# Altium schematic sheet Sheet1.SchDoc
size A3
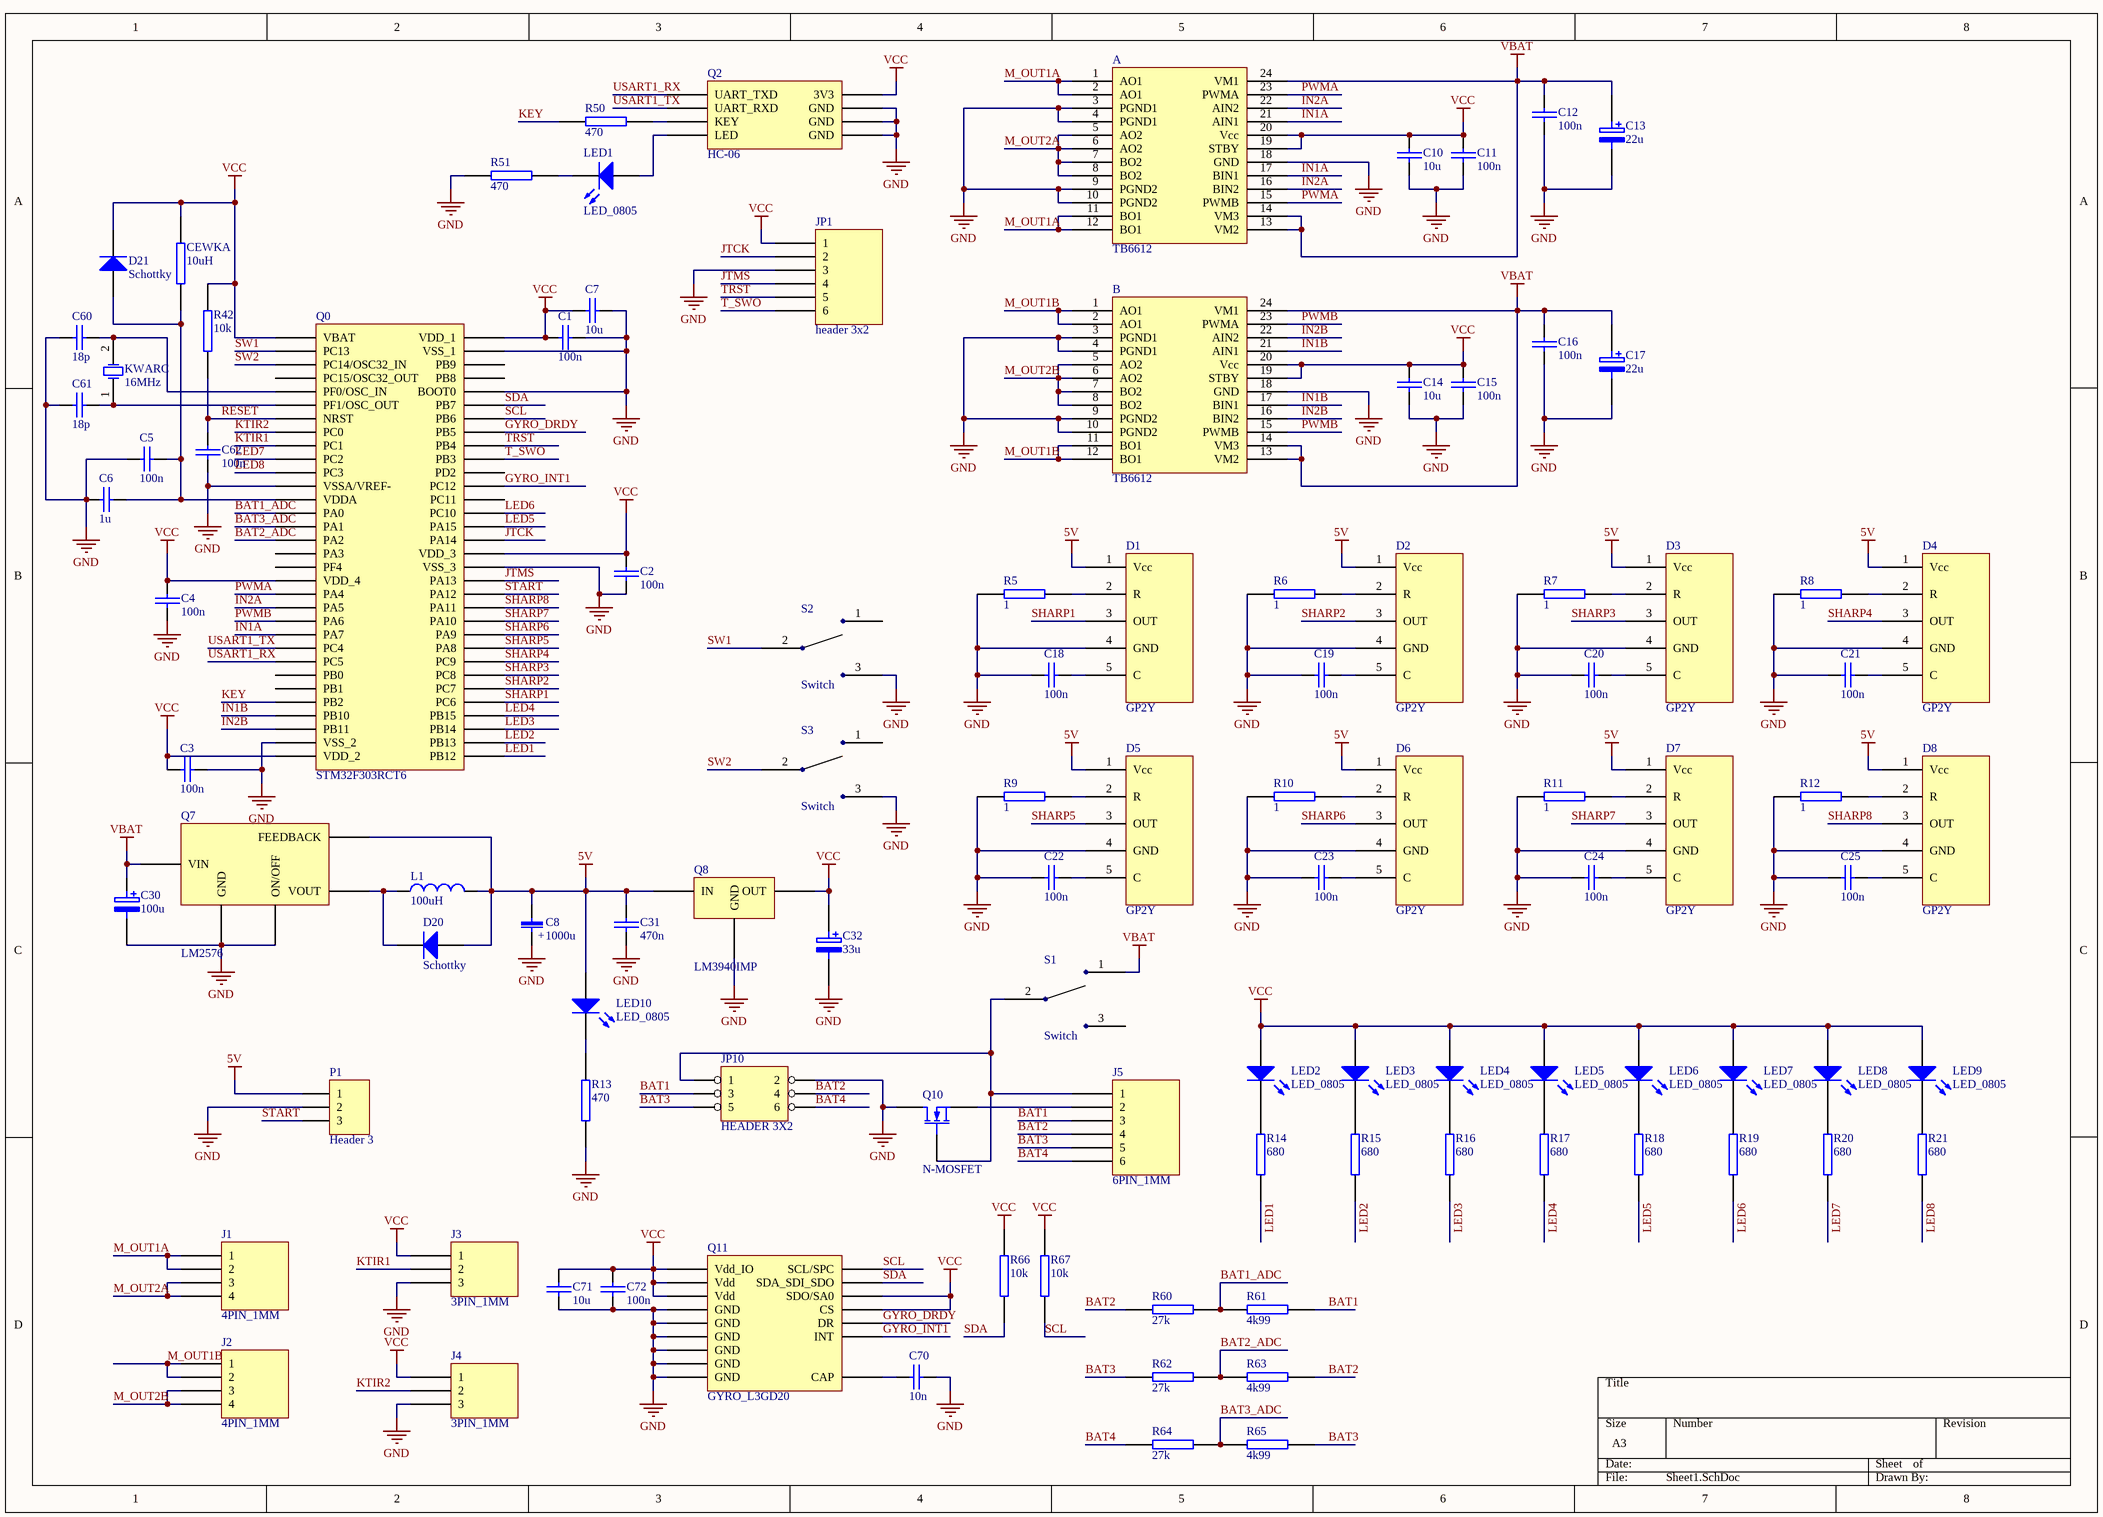
[diagram p0: Sheet1.SchDoc]

## Parts
A  TB6612  [SSOP24]
B  TB6612  [SSOP24]
C1  100n  [0805 CAP]
C2  100n  [0805 CAP]
C3  100n  [0805 CAP]
C4  100n  [0805 CAP]
C5  100n  [0805 CAP]
C6  1u  [0805 CAP]
C7  10u  [0805 CAP]
C8  1000u  [F720J108MMC]
C10  10u  [0805 CAP]
C11  100n  [0805 CAP]
C12  100n  [0805 CAP]
C13  22u  [TANTAL_A]
C14  10u  [0805 CAP]
C15  100n  [0805 CAP]
C16  100n  [0805 CAP]
C17  22u  [TANTAL_A]
C18  100n  [0805 CAP]
C19  100n  [0805 CAP]
C20  100n  [0805 CAP]
C21  100n  [0805 CAP]
C22  100n  [0805 CAP]
C23  100n  [0805 CAP]
C24  100n  [0805 CAP]
C25  100n  [0805 CAP]
C30  100u  [TANTAL_C]
C31  470n  [0805 CAP]
C32  33u  [TANTAL_C]
C60  18p  [0805 CAP]
C61  18p  [0805 CAP]
C62  100n  [0805 CAP]
C70  10n  [0805]
C71  10u  [0805]
C72  100n  [0805]
CEWKA  10uH  [0805]
D1  GP2Y  [gp2y smd]
D2  GP2Y  [gp2y smd]
D3  GP2Y  [gp2y smd]
D4  GP2Y  [gp2y smd]
D5  GP2Y  [gp2y smd]
D6  GP2Y  [gp2y smd]
D7  GP2Y  [gp2y smd]
D8  GP2Y  [gp2y smd]
D20  Schottky  [SMB]
D21  Schottky  [SMB]
J1  4PIN_1MM  [CON_1mm_4pin]
J2  4PIN_1MM  [CON_1mm_4pin]
J3  3PIN_1MM  [CON_1MM_3PIN]
J4  3PIN_1MM  [CON_1MM_3PIN]
J5  6PIN_1MM  [6pin]
JP1  header 3x2  [MM3X2 SMD]
JP10  HEADER 3X2  [MM3X2 SMD]
KWARC  16MHz  [KWARC_16M]
L1  100uH  [CEWKA]
LED1  LED_0805  [0805]
LED2  LED_0805  [0805]
LED3  LED_0805  [0805]
LED4  LED_0805  [0805]
LED5  LED_0805  [0805]
LED6  LED_0805  [0805]
LED7  LED_0805  [0805]
LED8  LED_0805  [0805]
LED9  LED_0805  [0805]
LED10  LED_0805  [0805]
P1  Header 3  [HDR1X3]
Q0  STM32F303RCT6  [STM32F303RCT6]
Q2  HC-06  [PCBComponent_1]
Q7  LM2576  [LM2576]
Q8  LM3940IMP  [LM3940IMP]
Q10  N-MOSFET  [DPAK]
Q11  GYRO_L3GD20  [GYRO_L3GD20]
R5  1  [0805 RES]
R6  1  [0805 RES]
R7  1  [0805 RES]
R8  1  [0805 RES]
R9  1  [0805 RES]
R10  1  [0805 RES]
R11  1  [0805 RES]
R12  1  [0805 RES]
R13  470  [0805 RES]
R14  680  [0805 RES]
R15  680  [0805 RES]
R16  680  [0805 RES]
R17  680  [0805 RES]
R18  680  [0805 RES]
R19  680  [0805 RES]
R20  680  [0805 RES]
R21  680  [0805 RES]
R42  10k  [0805]
R50  470  [0805 RES]
R51  470  [0805 RES]
R60  27k  [0805]
R61  4k99  [0805]
R62  27k  [0805]
R63  4k99  [0805]
R64  27k  [0805]
R65  4k99  [0805]
R66  10k  [0805]
R67  10k  [0805]
S1  Switch  [Switch]
S2  Switch  [Switch]
S3  Switch  [Switch]

## Nets
5V: C8.1 C31.2 D1.1(Vcc) D2.1(Vcc) D3.1(Vcc) D4.1(Vcc) D5.1(Vcc) D6.1(Vcc) D7.1(Vcc) D8.1(Vcc) D20.1(A) L1.2 LED10.2(A) P1.1 Q7.4(FEEDBACK) Q8.IN
GND: A.3(PGND1) A.4(PGND1) A.9(PGND2) A.10(PGND2) A.18(GND) B.3(PGND1) B.4(PGND1) B.9(PGND2) B.10(PGND2) B.18(GND) C1.2 C2.2 C3.2 C4.2 C5.2 C6.1 C7.2 C8.2 C10.2 C11.2 C12.2 C13.2 C14.2 C15.2 C16.2 C17.2 C18.1 C19.1 C20.1 C21.1 C22.1 C23.1 C24.1 C25.1 C30.2 C31.1 C32.2 C60.1 C61.2 C62.2 C70.1 C71.2 C72.2 D1.4(GND) D2.4(GND) D3.4(GND) D4.4(GND) D5.4(GND) D6.4(GND) D7.4(GND) D8.4(GND) J3.3 J4.3 JP1.3 JP10.2 P1.2 Q0.12(VSSA/VREF-) Q0.31(VSS_2) Q0.47(VSS_3) Q0.60(BOOT0) Q0.63(VSS_1) Q2.4(GND) Q2.5(GND) Q2.6(GND) Q7.3(GND) Q7.5(ON/OFF) Q8.GND Q10.2(D) Q11.8(GND) Q11.9(GND) Q11.10(GND) Q11.11(GND) Q11.12(GND) Q11.13(GND) R5.1 R6.1 R7.1 R8.1 R9.1 R10.1 R11.1 R12.1 R13.1 R51.1 S2.3 S3.3
VBAT: A.13(VM2) A.14(VM3) A.24(VM1) B.13(VM2) B.14(VM3) B.24(VM1) C12.1 C13.1 C16.1 C17.1 C30.1 Q7.1(VIN) S1.1
VCC: A.19(STBY) A.20(Vcc) B.19(STBY) B.20(Vcc) C1.1 C2.1 C3.1 C4.1 C7.1 C10.1 C11.1 C14.1 C15.1 C32.1 C71.1 C72.1 CEWKA.2 D21.2(K) J3.1 J4.1 JP1.1 LED2.2(A) LED3.2(A) LED4.2(A) LED5.2(A) LED6.2(A) LED7.2(A) LED8.2(A) LED9.2(A) Q0.1(VBAT) Q0.19(VDD_4) Q0.32(VDD_2) Q0.48(VDD_3) Q0.64(VDD_1) Q2.3(3V3) Q8.OUT Q11.1(Vdd_IO) Q11.4(SDO/SA0) Q11.5(CS) Q11.15(Vdd) Q11.16(Vdd) R42.2 R66.1 R67.1
BAT1: J5.3 JP10.3 R61.1
BAT1_ADC: Q0.14(PA0) R60.1 R61.2
BAT2: J5.4 JP10.4 R60.2 R63.1
BAT2_ADC: Q0.16(PA2) R62.1 R63.2
BAT3: J5.5 JP10.5 R62.2 R65.1
BAT3_ADC: Q0.15(PA1) R64.1 R65.2
BAT4: J5.6 JP10.6 R64.2
GYRO_DRDY: Q0.57(PB5) Q11.6(DR)
GYRO_INT1: Q0.53(PC12) Q11.7(INT)
IN1A: A.17(BIN1) A.21(AIN1) Q0.23(PA7)
IN1B: B.17(BIN1) B.21(AIN1) Q0.29(PB10)
IN2A: A.16(BIN2) A.22(AIN2) Q0.21(PA5)
IN2B: B.16(BIN2) B.22(AIN2) Q0.30(PB11)
JTCK: JP1.2 Q0.49(PA14)
JTMS: JP1.4 Q0.46(PA13)
KEY: Q0.28(PB2) R50.1
KTIR1: J3.2 Q0.9(PC1)
KTIR2: J4.2 Q0.8(PC0)
LED1: Q0.33(PB12) R14.1
LED2: Q0.34(PB13) R15.1
LED3: Q0.35(PB14) R16.1
LED4: Q0.36(PB15) R17.1
LED5: Q0.50(PA15) R18.1
LED6: Q0.51(PC10) R19.1
LED7: Q0.10(PC2) R20.1
LED8: Q0.11(PC3) R21.1
M_OUT1A: A.1(AO1) A.2(AO1) A.11(BO1) A.12(BO1) J1.1 J1.2
M_OUT1B: B.1(AO1) B.2(AO1) B.11(BO1) B.12(BO1) J2.1 J2.2
M_OUT2A: A.5(AO2) A.6(AO2) A.7(BO2) A.8(BO2) J1.3 J1.4
M_OUT2B: B.5(AO2) B.6(AO2) B.7(BO2) B.8(BO2) J2.3 J2.4
PWMA: A.15(PWMB) A.23(PWMA) Q0.20(PA4)
PWMB: B.15(PWMB) B.23(PWMA) Q0.22(PA6)
RESET: C62.1 Q0.7(NRST) R42.1
SCL: Q0.58(PB6) Q11.2(SCL/SPC) R67.2
SDA: Q0.59(PB7) Q11.3(SDA_SDI_SDO) R66.2
SHARP1: D1.3(OUT) Q0.37(PC6)
SHARP2: D2.3(OUT) Q0.38(PC7)
SHARP3: D3.3(OUT) Q0.39(PC8)
SHARP4: D4.3(OUT) Q0.40(PC9)
SHARP5: D5.3(OUT) Q0.41(PA8)
SHARP6: D6.3(OUT) Q0.42(PA9)
SHARP7: D7.3(OUT) Q0.43(PA10)
SHARP8: D8.3(OUT) Q0.44(PA11)
START: P1.3 Q0.45(PA12)
SW1: Q0.2(PC13) S2.2
SW2: Q0.3(PC14/OSC32_IN) S3.2
T_SWO: JP1.6 Q0.55(PB3)
TRST: JP1.5 Q0.56(PB4)
USART1_RX: Q0.25(PC5) Q2.1(UART_TXD)
USART1_TX: Q0.24(PC4) Q2.2(UART_RXD)
NetC5_1: C5.1 C6.2 CEWKA.1 D21.1(A) Q0.13(VDDA)
NetC18_2: C18.2 D1.5(C)
NetC19_2: C19.2 D2.5(C)
NetC20_2: C20.2 D3.5(C)
NetC21_2: C21.2 D4.5(C)
NetC22_2: C22.2 D5.5(C)
NetC23_2: C23.2 D6.5(C)
NetC24_2: C24.2 D7.5(C)
NetC25_2: C25.2 D8.5(C)
NetC60_2: C60.2 KWARC.2(OSC2) Q0.5(PF0/OSC_IN)
NetC61_1: C61.1 KWARC.1(OSC1) Q0.6(PF1/OSC_OUT)
NetC70_2: C70.2 Q11.14(CAP)
NetD1_2: D1.2(R) R5.2
NetD2_2: D2.2(R) R6.2
NetD3_2: D3.2(R) R7.2
NetD4_2: D4.2(R) R8.2
NetD5_2: D5.2(R) R9.2
NetD6_2: D6.2(R) R10.2
NetD7_2: D7.2(R) R11.2
NetD8_2: D8.2(R) R12.2
NetD20_2: D20.2(K) L1.1 Q7.2(VOUT)
NetJ5_1: J5.1 JP10.1 Q10.1(G) S1.2
NetJ5_2: J5.2 Q10.3(S)
NetLED1_1: LED1.1(K) R51.2
NetLED1_2: LED1.2(A) Q2.7(LED)
NetLED2_1: LED2.1(K) R14.2
NetLED3_1: LED3.1(K) R15.2
NetLED4_1: LED4.1(K) R16.2
NetLED5_1: LED5.1(K) R17.2
NetLED6_1: LED6.1(K) R18.2
NetLED7_1: LED7.1(K) R19.2
NetLED8_1: LED8.1(K) R20.2
NetLED9_1: LED9.1(K) R21.2
NetLED10_1: LED10.1(K) R13.2
NetQ2_8: Q2.8(KEY) R50.2

Not connected (* = marked no-connect by the designer): Q0 4(PC15/OSC32_OUT) 17(PA3) 18(PF4) 26(PB0) 27(PB1) 52(PC11) 54(PD2) 61(PB8) 62(PB9); S1 3; S2 1; S3 1

## Notes on the sheet
- (in symbol 1000u) +

## Library data of the parts
C1-C7 C10-C12 C14-C16 C18-C25 C31 C60-C62 C70-C72 = CAP: Capacitor
C8 = 1000u: F720J108MMC
C13 C17 = E
C30 C32 = ELECTRO2: Electrolytic Capacitor
CEWKA R5-R21 R42 R50 R51 R60-R67 = R
D1-D8 = GP2Y: pin to pad: 1>5 2>4 4>2 5>1
J1 J2 = CON_1MM_4PIN
J3 J4 = CON_1MM_3PIN
J5 JP1 = CON_1MM_6PIN
KWARC = XTAL: Crystal Oscillator; Published: 8-Jun-2000; LatestRevisionDate: 17-Jul-2002; LatestRevisionNote: Re-released for DXP Platform.; PackageReference: R38; Publisher: Altium Limited; PackageDescription: Crystal, Thru-Hole; 2 Leads; Body 3.1 x 8.2 mm (Dia.xH)
L1 = CEWKA
P1 = Header 3: Header, 3-Pin; LatestRevisionDate: 17-Jul-2002; LatestRevisionNote: Re-released for DXP Platform.; Publisher: Altium Limited
Q0 = STM32F303RCT6: pin to pad: 1>VBAT 2>PC13 3>PC14/OSC32_IN 4>PC15/OSC32_OUT 5>PF0/OSC_IN 6>PF1/OSC_OUT 7>NRST 8>PC0 9>PC1 10>PC2 11>PC3 12>VSSA/VREF- 13>VDDA 14>PA0 15>PA1 16>PA2 17>PA3 18>PF4 19>VDD_4 20>PA4 21>PA5 22>PA6 23>PA7 24>PC4 25>PC5 26>PB0 27>PB1 28>PB2 29>PB10 30>PB11 31>VSS_2 32>VDD_2 33>PB12 34>PB13 35>PB14 36>PB15 37>PC6 38>PC7 39>PC8 40>PC9 41>PA8 42>PA9 43>PA10 44>PA11 45>PA12 46>PA13 47>VSS_3 48>VDD_3 49>PA14 50>PA15 51>PC10 52>PC11 53>PC12 54>PD2 55>PB3 56>PB4 57>PB5 58>PB6 59>PB7 60>BOOT0 61>PB8 62>PB9 63>VSS_1 64>VDD_1
Q2 = Component_1: Bluetooth; pin to pad: 1>UART_TXD 2>UART_RXD 3>3V3 4>GND 5>GND 6>GND 7>LED 8>KEY
Q10 = n-mosfet: pin to pad: 2>4